# Altium schematic sheet Power.SchDoc
size A; SheetNumber: 5; SheetTotal: 5
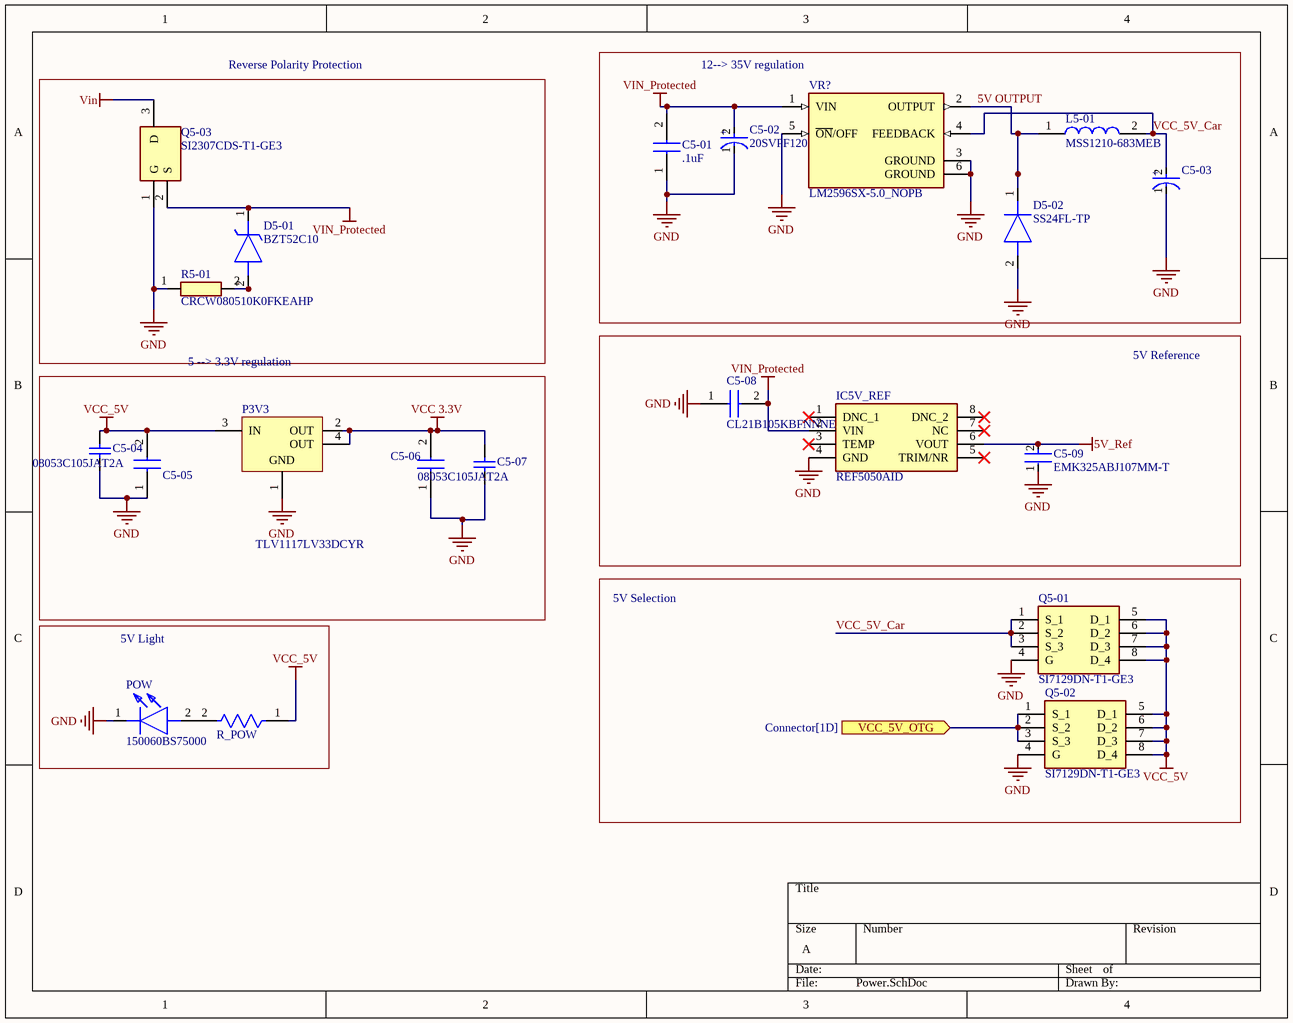
[diagram p0: Power.SchDoc]

## Parts
C5-01  .1uF  [CAPC2012X95N]
C5-02  20SVPF120M  [FP-OS-CON-SMT-C6-MFG]
C5-03  EEE-FK1H221GP  [FP-FKG-MFG]  (value not drawn)
C5-04  08053C105JAT2A  [CAPC2013X140X50ML20T25]
C5-05  CL21B104KBCNNNC  [CAPC2012X95N]  (value not drawn)
C5-06  CL21B104KBCNNNC  [CAPC2012X95N]  (value not drawn)
C5-07  08053C105JAT2A  [CAPC2013X140X50ML20T25]
C5-08  CL21B105KBFNNNE  [CAPC2012X135N]
C5-09  EMK325ABJ107MM-T  [FP-EMK325A-M-MFG]
D5-01  BZT52C10  [SOD3716X125N]
D5-02  SS24FL-TP  [SODFL5026X125N]
IC5V_REF  REF5050AID  [SOIC127P600X175-8N]
L5-01  MSS1210-683MEB  [INDPM120120X1020N]
P3V3  TLV1117LV33DCYR  [DCY0004A_N]
POW  150060BS75000  [LEDC1608X80N]
Q5-01  SI7129DN-T1-GE3  [SIS862DNT1GE3]
Q5-02  SI7129DN-T1-GE3  [SIS862DNT1GE3]
Q5-03  SI2307CDS-T1-GE3  [SOT95P237X112-3N]
R5-01  CRCW080510K0FKEAHP  [RESC2012X60N]
R_POW  CRCW08051K00FKEC  [FP-CRCW0805-e3-MFG]  (value not drawn)
VR?  LM2596SX-5.0_NOPB  [VREG_LM2596SX-5.0_NOPB]

## Blocks framed on the sheet
12--> 35V regulation: C5-01 C5-02 C5-03 D5-02 L5-01 VR?
Reverse Polarity Protection: D5-01 Q5-03 R5-01
5V Reference: C5-08 C5-09 IC5V_REF
5 --> 3.3V regulation: C5-04 C5-05 C5-06 C5-07 P3V3
5V Selection: Q5-01 Q5-02
5V Light: POW R_POW

## Ports
VCC_5V_OTG (in, see Connector[1D])

## Nets
5V_Ref: C5-09.2 IC5V_REF.6(VOUT)
GND: C5-01.1 C5-02.1(C) C5-03.1(C) C5-04.1 C5-05.1 C5-06.1 C5-07.1 C5-08.1 C5-09.1 D5-02.2(A) IC5V_REF.4(GND) P3V3.1(GND) POW.1(K) Q5-01.4(G) Q5-02.4(G) Q5-03.1(G) R5-01.1 VR?.3(GROUND) VR?.5(~{ON}/OFF) VR?.6(GROUND)
VCC 3.3V: C5-06.2 C5-07.2 P3V3.2(OUT) P3V3.4(OUT)
VCC_5V: C5-04.2 C5-05.2 P3V3.3(IN) Q5-01.5(D_1) Q5-01.6(D_2) Q5-01.7(D_3) Q5-01.8(D_4) Q5-02.5(D_1) Q5-02.6(D_2) Q5-02.7(D_3) Q5-02.8(D_4) R_POW.1
Vin: Q5-03.3(D)
VIN_Protected: C5-01.2 C5-02.2(A) C5-08.2 D5-01.1(K) IC5V_REF.2(VIN) Q5-03.2(S) VR?.1(VIN)
5V OUTPUT: D5-02.1(K) L5-01.1 VR?.2(OUTPUT)
VCC_5V_Car: C5-03.2(A) L5-01.2 Q5-01.1(S_1) Q5-01.2(S_2) Q5-01.3(S_3) VR?.4(FEEDBACK)
VCC_5V_OTG: Q5-02.1(S_1) Q5-02.2(S_2) Q5-02.3(S_3) ; port VCC_5V_OTG
NetD5-01_2: D5-01.2(A) R5-01.2
NetPOW_2: POW.2(A) R_POW.2

Not connected (* = marked no-connect by the designer): IC5V_REF 1(DNC_1)* 3(TEMP)* 5(TRIM/NR)* 7(NC)* 8(DNC_2)*

## Notes on the sheet
- (in symbol CMP-05427-000099-1) +
- (in symbol CMP-05428-001333-1) +

## Library data of the parts
C5-01 = CL21B104KBCNNNC: Capacitor; Manufacturer_Name: SAMSUNG; Datasheet Link: https://datasheet.datasheetarchive.com/originals/distributors/Datasheets_SAMA/86a3eaf0882763ef32124d5901f9b833.pdf; Height: 0.95mm; Manufacturer_Part_Number: CL21B104KBCNNNC; Mouser Part Number: 187-CL21B104KBCNNNC; Mouser Price/Stock: https://www.mouser.co.uk/ProductDetail/Samsung-Electro-Mechanics/CL21B104KBCNNNC?qs=349EhDEZ59pEfpnm5yBEmQ%3D%3D; Arrow Part Number: CL21B104KBCNNNC; Arrow Price/Stock: https://www.arrow.com/en/products/cl21b104kbcnnnc/samsung-electro-mechanics?region=europe
C5-02 = CMP-05428-001333-1: Conductive Polymer Aluminum Solid Capacitors (OS-CON) 120uF ±20% 20V; Polarity: Polar; ESR (Equivalent Series Resistance): 25mR; Leakage Current: 480uA; Ripple Current: 3.2A; Life (Hours): 5000Hour; Dissipation Factor: 12%; Lead Free: Lead Free; Voltage Rating: 20V; Packaging: Tape and Reel; Min Operating Temperature: -55°C; Tolerance: 20%; Diameter: 6.3mm; Max Operating Temperature: 105°C; Length: 5.9mm; Termination: SMD/SMT; Height - Seated (Max): 0.236inch; REACH SVHC: No SVHC; Voltage Rating (DC): 20V; Voltage: 20V; Material: Polymer; Ripple Current (AC): 3.2A; Series: OS-CON™, SVPF; RoHS Compliant: Yes; Mount: Surface Mount; Height: 5.9mm; Package Quantity: 1000; Radiation Hardening: No; Construction: Cylindrical; Case/Package: Radial; Capacitance: 120uF; Number of Pins: 6
C5-03 = CMP-05427-000099-1: CAP ALUM 220UF 20% 50V SMD; Ripple Current (AC): 670mA; ESR (Equivalent Series Resistance): 180mR; Life (Hours): 5000Hour; Polarity: Polar; Dissipation Factor: 0.1%; Leakage Current: 3uA; Lead Free: Lead Free; Max Operating Temperature: 105°C; Ripple Current: 670mA; Radiation Hardening: No; Width: 12mm; Packaging: Tape and Reel; Voltage: 50V; Capacitance: 220uF; Series: FK; Mount: Surface Mount; Diameter: 10mm; Min Operating Temperature: -55°C; Voltage Rating: 50V; Tolerance: 20%; Length: 10.2mm; Contact Plating: Tin; REACH SVHC: No SVHC; Number of Pins: 2; Construction: Cylindrical; Impedance: 180mR; Termination: SMD/SMT; Voltage Rating (DC): 50V; Height - Seated (Max): 0.413inch; Case/Package: Radial; RoHS Compliant: Yes; Package Quantity: 500; Height: 10.2mm
C5-04 C5-07 = CMP-1036-04752-2: Manufacturer: AVX Interconnect / Elco; Part Number: 08053C105JAT2A
C5-05 C5-06 = CMP-001-00017-1: Capacitor; Manufacturer_Name: SAMSUNG; Source: SamacSys.SchLib; Mouser Part Number: 187-CL21B104KBCNNNC; Design Item ID: CL21B104KBCNNNC; Manufacturer_Part_Number: CL21B104KBCNNNC; Arrow Part Number: CL21B104KBCNNNC; Datasheet Link: https://datasheet.datasheetarchive.com/originals/distributors/Datasheets_SAMA/86a3eaf0882763ef32124d5901f9b833.pdf; Arrow Price/Stock: https://www.arrow.com/en/products/cl21b104kbcnnnc/samsung-electro-mechanics?region=europe; Height: 0.95mm; Mouser Price/Stock: https://www.mouser.co.uk/ProductDetail/Samsung-Electro-Mechanics/CL21B104KBCNNNC?qs=349EhDEZ59pEfpnm5yBEmQ%3D%3D
C5-08 = CL21B105KBFNNNE: Capacitor; Manufacturer_Name: SAMSUNG; Datasheet Link: https://componentsearchengine.com/Datasheets/2/CL21B105KBFNNNE.pdf; Height: 1.35mm; Manufacturer_Part_Number: CL21B105KBFNNNE; Mouser Part Number: 187-CL21B105KBFNNNE; Mouser Price/Stock: https://www.mouser.co.uk/ProductDetail/Samsung-Electro-Mechanics/CL21B105KBFNNNE?qs=yOVawPpwOwmddQEBPU6Y9A%3D%3D; Arrow Part Number: CL21B105KBFNNNE; Arrow Price/Stock: https://www.arrow.com/en/products/cl21b105kbfnnne/samsung-electro-mechanics?utm_currency=USD&region=europe
C5-09 = CMP-2000-05020-2: CAP CER 100UF 16V X5R 1210; Manufacturer: Taiyo Yuden; Material: Ceramic; Temperature Coefficient: 15%; Tolerance: 20%; Ipc Land Pattern Name: CAPC320250X250; Package: EMK325A-M; Device Class L1: Passive Components; Height: 2.8mm; Device Class L2: Capacitors; Temperature Range Low: -55°C; RoHS: TRUE; Temperature Characteristic: X5R; Mouser Description: 1210 100 uF 16 V ±20% Tolerance X5R SMT Multilayer Ceramic Capacitor; ComponentLink2Description: Datasheet; Temperature: -55°C to +85°C; Device Class L3: Ceramic Capacitors; Capacitance: 100uF; Lead Free: Yes; Category: Cap; Octopart: https://octopart.com/emk325abj107mm-t-taiyo+yuden-20815747; Temperature Range High: +85°C; Automotive: No; Manufacturer Part Number: EMK325ABJ107MM-T; Value: 100uF; Digikey Description: CAP CER 100UF 16V X5R 1210; Voltage Rating: 16V; ComponentLink2URL: https://www.yuden.co.jp/productdata/catalog/mlcc01_e.pdf
D5-01 = BZT52C10: Zener Diode; Manufacturer_Name: Multicomp Pro; Datasheet Link: https://www.farnell.com/datasheets/3006306.pdf; Height: 1.25mm; Manufacturer_Part_Number: BZT52C10
D5-02 = SS24FL-TP: Diode; Manufacturer_Name: MCC; Datasheet Link: https://www.mccsemi.com/pdf/Products/SS22FL-SS210FL(DO-221AC).pdf; Height: 1.25mm; Manufacturer_Part_Number: SS24FL-TP; Mouser Part Number: 833-SS24FL-TP; Mouser Price/Stock: https://www.mouser.co.uk/ProductDetail/Micro-Commercial-Components-MCC/SS24FL-TP?qs=P1JMDcb91o5c0D9%2FtR3zeg%3D%3D; Arrow Part Number: SS24FL-TP; Arrow Price/Stock: https://www.arrow.com/en/products/ss24fl-tp/micro-commercial-components?utm_currency=USD&region=nac
IC5V_REF = REF5050AID: Integrated Circuit; Manufacturer_Name: Texas Instruments; Datasheet Link: http://www.ti.com/lit/ds/symlink/ref5050.pdf; Height: 1.75mm; Manufacturer_Part_Number: REF5050AID; Mouser Part Number: 595-REF5050AID; Mouser Price/Stock: https://www.mouser.co.uk/ProductDetail/Texas-Instruments/REF5050AID?qs=xL7PkI2RoJ7XYYmtyv4B4g%3D%3D; Arrow Part Number: REF5050AID; Arrow Price/Stock: https://www.arrow.com/en/products/ref5050aid/texas-instruments?utm_currency=USD&region=nac
L5-01 = MSS1210-683MEB: Inductor; Manufacturer_Name: COILCRAFT; Datasheet Link: https://www.coilcraft.com/pdfs/MSS1210.pdf; Height: 10.2mm; Manufacturer_Part_Number: MSS1210-683MEB; Mouser Part Number: 994-MSS1210-683MEB; Mouser Price/Stock: https://www.mouser.co.uk/ProductDetail/Coilcraft/MSS1210-683MEB?qs=VJjuEbE9QBMI97JuBdk8YQ%3D%3D
P3V3 = CMP-0395-00503-2: Single Output LDO, 1 A, Fixed 3.3 V Output, 2 to 5.5 V Input, 4-pin SOT-223 (DCY), -40 to 125 degC, Green (RoHS & no Sb/Br); Manufacturer: Texas Instruments; Vout Adj(Min)(V): 3.3; Vdo(Typ)(mV): 1200; Iq(Typ)(mA): 0.05; Accuracy(%): 2; Iout(Max)(A): 1; SubFamily: Single Channel LDO; Vin(Max)(V): 5.5; PackageReference: DCY0004A; PackageDescription: 4-Pin Plastic Small Outline, Body 3.5 x 6.5 mm, Pitch 2.3 mm; Vout Adj(Max)(V): 3.3; Mounting Technology: Surface Mount; ComponentLink2Description: Datasheet; ComponentLink1Description: Manufacturer URL; PartNumber: TLV1117LV33DCYR; ComponentLink3Description: Package Specification; ComponentLink1URL: http://www.ti.com/; ComponentLink2URL: http://www.ti.com/general/docs/lit/getliterature.tsp?genericPartNumber=TLV1117LV33&fileType=pdf; Fixed Output Options(V): 3.3; PackageVersion: 4202506/B; Vin(Min)(V): 2; DatasheetVersion: SBVS160A; Eco-Plan: Green (RoHS & no Sb/Br); ComponentLink3URL: http://www.ti.com/litv/pdf/mpds094a; Code_JEDEC: TO-261
POW = 150060BS75000: LED; Manufacturer_Name: Wurth Elektronik; Datasheet Link: https://componentsearchengine.com/Datasheets/2/150060BS75000.pdf; Height: 0.8mm; Manufacturer_Part_Number: 150060BS75000; Mouser Part Number: 710-150060BS75000; Mouser Price/Stock: https://www.mouser.co.uk/ProductDetail/Wurth-Elektronik/150060BS75000?qs=LlUlMxKIyB2DLLpXQThavA%3D%3D
Q5-01 Q5-02 = CMP-027-000002-1: MOSFET (P-Channel); Manufacturer_Name: Vishay; Source: SamacSys.SchLib; Datasheet Link: https://www.vishay.com/docs/68966/si7129dn.pdf; Mouser Part Number: 781-SI7129DN-GE3; Manufacturer_Part_Number: SI7129DN-T1-GE3; Design Item ID: SI7129DN-T1-GE3; Mouser Price/Stock: https://www.mouser.co.uk/ProductDetail/Vishay-Semiconductors/SI7129DN-T1-GE3?qs=LWWr1WFOkdGr29jiBIQirw%3D%3D; Arrow Part Number: SI7129DN-T1-GE3; Arrow Price/Stock: https://www.arrow.com/en/products/si7129dn-t1-ge3/vishay?region=nac
Q5-03 = CMP-031-00028-1: Integrated Circuit; Manufacturer_Name: Vishay; Datasheet Link: https://datasheet.datasheetarchive.com/originals/dk/DKDS-23/454595.pdf; Mouser Part Number: 781-SI2307CDS-T1-GE3; Manufacturer_Part_Number: SI2307CDS-T1-GE3; Mouser Price/Stock: https://www.mouser.co.uk/ProductDetail/Vishay-Semiconductors/SI2307CDS-T1-GE3?qs=IRuQNBqMOclRDJ6AKMlnoQ%3D%3D; Height: 1.12mm; Arrow Price/Stock: https://www.arrow.com/en/products/si2307cds-t1-ge3/vishay?region=nac; Source: SamacSys.SchLib; Design Item ID: SI2307CDS-T1-GE3; Arrow Part Number: SI2307CDS-T1-GE3
R5-01 = CRCW080510K0FKEAHP: Resistor; Manufacturer_Name: Vishay; Datasheet Link: https://componentsearchengine.com/Datasheets/1/CRCW08051R00FKEAHP.pdf; Height: 0.6mm; Manufacturer_Part_Number: CRCW080510K0FKEAHP; Mouser Part Number: 71-CRCW080510K0FKEAH; Mouser Price/Stock: https://www.mouser.co.uk/ProductDetail/Vishay-Dale/CRCW080510K0FKEAHP?qs=FlFvgi4rxBybVOW6oiRQjA%3D%3D; Arrow Part Number: CRCW080510K0FKEAHP; Arrow Price/Stock: https://www.arrow.com/en/products/crcw080510k0fkeahp/vishay?utm_currency=USD&region=europe
R_POW = CMP-02407-003828-1: RES Thick Film, 1kΩ, 1%, 0.125W, 100ppm/°C, 0805; Power Rating: 125mW; Resistance: 1kR; Tolerance: 1%; Height: 0.02inch; Features: Automotive AEC-Q200; Case/Package: 0805; Composition: Thick Film; Length: 2mm; Width: 0.049inch; Max Operating Temperature: 155°C; Mount: Surface Mount; Contact Plating: Tin; Temperature Coefficient: 100ppm/°C; Min Operating Temperature: -55°C; Number of Terminations: 2; Max Power Dissipation: 125mW; Lead Free: Lead Free; Military Standard: Not; Termination: Wraparound; Depth: 1.25mm; Package Quantity: 20000; Packaging: Tape and Reel
VR? = CMP-058-000000-1: SIMPLE SWITCHERÂ® 4.5V to 40V, 3A Low Component Count Step-Down Regulator; MF: Texas Instruments; MP: LM2596SX-5.0/NOPB; Pin Count: 6; Value: *; Source: LM2596SX-5.0_NOPB.SchLib; Design Item ID: LM2596SX-5.0_NOPB; Check_prices: https://www.snapeda.com/parts/LM2596SX-5.0/NOPB/Texas+Instruments/view-part/?ref=eda; SnapEDA_Link: https://www.snapeda.com/parts/LM2596SX-5.0/NOPB/Texas+Instruments/view-part/?ref=snap; Package: TO-263-5 Texas Instruments; Component Type: Standard